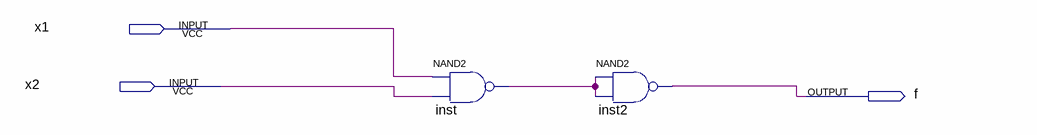
[diagram p0: schematic sheet]
// Quartus schematic Q2.bdf as structural Verilog: 2 symbols, 3 pins
module Q2 (
  input  x1,
  input  x2,
  output f
);

  wire inst_out;

  nand inst (inst_out, x1, x2);
  nand inst2 (f, inst_out, inst_out);
endmodule
